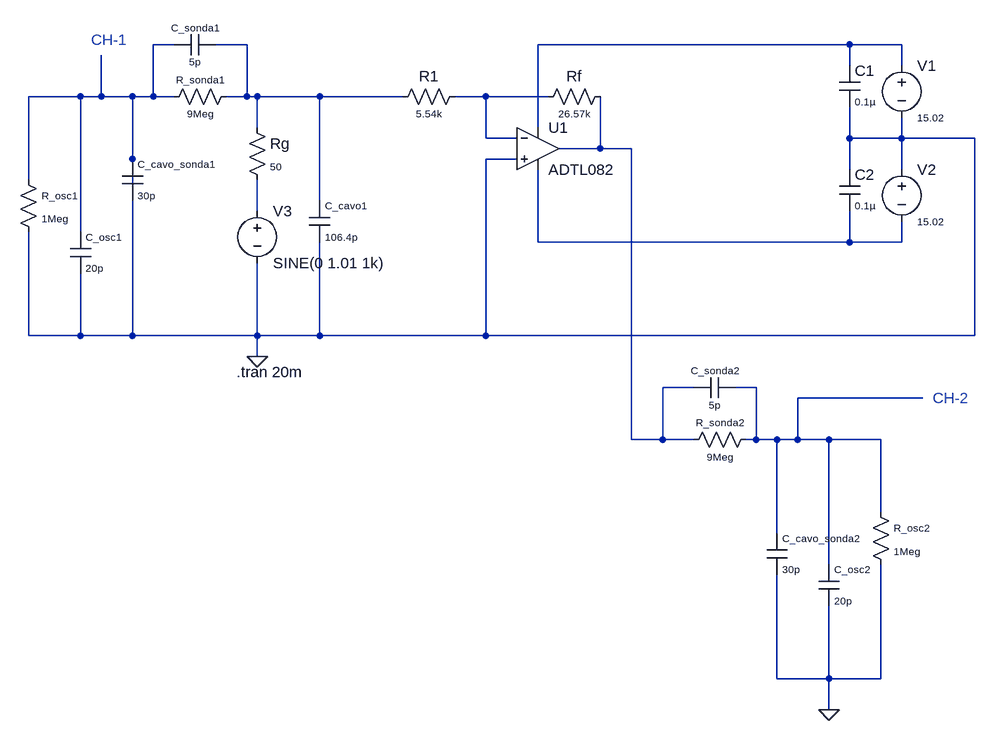
[diagram p0: schematic Op_Inv.asc]
Op_Inv.asc, the LTspice schematic file:
Version 4.1
SHEET 1 980 1028
WIRE -256 -16 -288 -16
WIRE -144 -16 -192 -16
WIRE 784 -16 304 -16
WIRE 864 -16 784 -16
WIRE 784 16 784 -16
WIRE 864 16 864 -16
WIRE -400 64 -480 64
WIRE -368 64 -368 0
WIRE -368 64 -400 64
WIRE -320 64 -368 64
WIRE -288 64 -288 -16
WIRE -288 64 -320 64
WIRE -256 64 -288 64
WIRE -144 64 -144 -16
WIRE -144 64 -176 64
WIRE -128 64 -144 64
WIRE -32 64 -128 64
WIRE 96 64 -32 64
WIRE 224 64 176 64
WIRE 320 64 224 64
WIRE -128 112 -128 64
WIRE 304 112 304 -16
WIRE 224 128 224 64
WIRE 272 128 224 128
WIRE 784 128 784 80
WIRE 864 128 864 96
WIRE 864 128 784 128
WIRE 976 128 864 128
WIRE 400 144 400 64
WIRE 400 144 336 144
WIRE 448 144 400 144
WIRE -320 160 -320 64
WIRE 272 160 224 160
WIRE 784 176 784 128
WIRE 864 176 864 128
WIRE -480 192 -480 64
WIRE -320 208 -320 160
WIRE -32 224 -32 64
WIRE -128 240 -128 192
WIRE -400 272 -400 64
WIRE 304 288 304 176
WIRE 784 288 784 240
WIRE 784 288 304 288
WIRE 864 288 864 256
WIRE 864 288 784 288
WIRE -480 432 -480 272
WIRE -400 432 -400 336
WIRE -400 432 -480 432
WIRE -320 432 -320 224
WIRE -320 432 -400 432
WIRE -128 432 -128 320
WIRE -128 432 -320 432
WIRE -32 432 -32 288
WIRE -32 432 -128 432
WIRE 224 432 224 160
WIRE 224 432 -32 432
WIRE 976 432 976 128
WIRE 976 432 224 432
WIRE -128 464 -128 432
WIRE 544 512 496 512
WIRE 640 512 608 512
WIRE 896 528 704 528
WIRE 448 592 448 144
WIRE 496 592 496 512
WIRE 496 592 448 592
WIRE 544 592 496 592
WIRE 640 592 640 512
WIRE 640 592 624 592
WIRE 672 592 640 592
WIRE 704 592 704 528
WIRE 704 592 672 592
WIRE 752 592 704 592
WIRE 832 592 752 592
WIRE 832 704 832 592
WIRE 672 736 672 592
WIRE 752 784 752 592
WIRE 672 960 672 800
WIRE 752 960 752 848
WIRE 752 960 672 960
WIRE 832 960 832 784
WIRE 832 960 752 960
WIRE 752 1008 752 960
FLAG -128 464 0
FLAG 752 1008 0
SYMBOL OpAmps\\ADTL082 304 80 R0
SYMATTR InstName U1
SYMBOL voltage 864 0 R0
WINDOW 3 24 96 Left 1
WINDOW 123 0 0 Left 0
WINDOW 39 0 0 Left 0
SYMATTR Value 15.02
SYMATTR InstName V1
SYMBOL voltage 864 160 R0
WINDOW 3 24 96 Left 1
WINDOW 123 0 0 Left 0
WINDOW 39 0 0 Left 0
SYMATTR Value 15.02
SYMATTR InstName V2
SYMBOL cap 768 16 R0
WINDOW 3 24 56 Left 1
SYMATTR Value 0.1µ
SYMATTR InstName C1
SYMBOL cap 768 176 R0
WINDOW 3 24 56 Left 1
SYMATTR Value 0.1µ
SYMATTR InstName C2
SYMBOL voltage -128 224 R0
WINDOW 123 0 0 Left 0
WINDOW 39 0 0 Left 0
SYMATTR InstName V3
SYMATTR Value SINE(0 1.01 1k)
SYMBOL res -144 96 R0
WINDOW 3 36 76 Left 1
SYMATTR Value 50
SYMATTR InstName Rg
SYMBOL res 416 48 R90
WINDOW 0 0 56 VBottom 2
WINDOW 3 32 56 VTop 1
SYMATTR InstName Rf
SYMATTR Value 26.57k
SYMBOL res 192 48 R90
WINDOW 0 0 56 VBottom 2
WINDOW 3 32 56 VTop 1
SYMATTR InstName R1
SYMATTR Value 5.54k
SYMBOL res -160 48 R90
WINDOW 0 0 56 VBottom 1
WINDOW 3 32 56 VTop 1
SYMATTR InstName R_sonda1
SYMATTR Value 9Meg
SYMBOL cap -192 -32 R90
WINDOW 0 0 32 VBottom 1
WINDOW 3 32 32 VTop 1
SYMATTR InstName C_sonda1
SYMATTR Value 5p
SYMBOL res -496 176 R0
WINDOW 0 36 40 Left 1
WINDOW 3 36 76 Left 1
SYMATTR InstName R_osc1
SYMATTR Value 1Meg
SYMBOL cap -416 272 R0
WINDOW 0 24 8 Left 1
WINDOW 3 24 56 Left 1
SYMATTR InstName C_osc1
SYMATTR Value 20p
SYMBOL cap -336 160 R0
WINDOW 0 24 8 Left 1
WINDOW 3 24 56 Left 1
SYMATTR InstName C_cavo_sonda1
SYMATTR Value 30p
SYMBOL res 640 576 R90
WINDOW 0 0 56 VBottom 1
WINDOW 3 32 56 VTop 1
SYMATTR InstName R_sonda2
SYMATTR Value 9Meg
SYMBOL cap 608 496 R90
WINDOW 0 0 32 VBottom 1
WINDOW 3 32 32 VTop 1
SYMATTR InstName C_sonda2
SYMATTR Value 5p
SYMBOL cap 656 736 R0
WINDOW 0 24 8 Left 1
WINDOW 3 24 56 Left 1
SYMATTR InstName C_cavo_sonda2
SYMATTR Value 30p
SYMBOL cap 736 784 R0
WINDOW 0 24 8 Left 1
WINDOW 3 24 56 Left 1
SYMATTR InstName C_osc2
SYMATTR Value 20p
SYMBOL res 816 688 R0
WINDOW 0 36 40 Left 1
WINDOW 3 36 76 Left 1
SYMATTR InstName R_osc2
SYMATTR Value 1Meg
SYMBOL cap -48 288 M180
WINDOW 0 24 56 Left 1
WINDOW 3 24 8 Left 1
SYMATTR InstName C_cavo1
SYMATTR Value 106.4p
TEXT -160 488 Left 2 !.tran 20m
TEXT -384 -24 Left 2 ;CH-1
TEXT 912 528 Left 2 ;CH-2

The netlist it stands for:
* Op_Inv.asc
X§U1 0 N004 N003 N007 N005 ADTL082  ; pins In+ In- V+ V- OUT
V1 N003 0 15.02
V2 0 N007 15.02
C1 N003 0 0.1µ
C2 0 N007 0.1µ
V3 N006 0 SINE(0 1.01 1k)
Rg N002 N006 50
Rf N005 N004 26.57k
R1 N004 N002 5.54k
R_sonda1 N002 N001 9Meg
C_sonda1 N002 N001 5p
R_osc1 N001 0 1Meg
C_osc1 N001 0 20p
C_cavo_sonda1 N001 0 30p
R_sonda2 N008 N005 9Meg
C_sonda2 N008 N005 5p
C_cavo_sonda2 N008 0 30p
C_osc2 N008 0 20p
R_osc2 N008 0 1Meg
C_cavo1 0 N002 106.4p
.tran 20m
* CH-1
* CH-2
.lib ADI.lib
.backanno
.end